# Altium schematic sheet External Temp Sensor.SchDoc
size A4; SheetNumber: 1; SheetTotal: 1
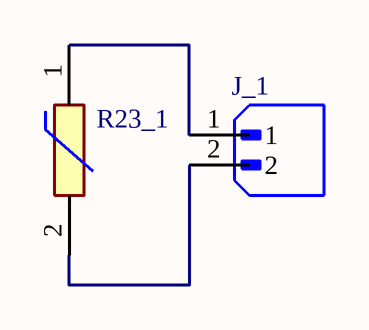
[diagram p0: External Temp Sensor.SchDoc]

## Parts
J_1  B2B-XH-A(LF)(SN)  [JST_B2B-XH-A(LF)(SN)]  (value not drawn)
R23_1  NTCS0805E3104GMT  [THRMC2012X95N]  (value not drawn)

## Nets
NetJ_1_1: J_1.1 R23_1.1
NetJ_1_2: J_1.2 R23_1.2

## Library data of the parts
J_1 = B2B-XH-A(LF)(SN): Connector Header Through Hole 2 position 0.098 (2.50mm); MF: JST Sales America Inc.; SnapEDA_Link: https://www.snapeda.com/parts/B2B-XH-A(LF)(SN)/JST+Sales+America+Inc./view-part/?ref=snap; Package: None; Value: *; MP: B2B-XH-A(LF)(SN); Check_prices: https://www.snapeda.com/parts/B2B-XH-A(LF)(SN)/JST+Sales+America+Inc./view-part/?ref=eda
R23_1 = NTCS0805E3104GMT: Thermistor; Manufacturer_Name: Vishay; Datasheet Link: http://www.vishay.com/docs/29044/ntcs0805e3t.pdf; Height: 0.95mm; Manufacturer_Part_Number: NTCS0805E3104GMT; Mouser Part Number: 594-NTCS0805E3104GMT; Mouser Price/Stock: https://www.mouser.co.uk/ProductDetail/Vishay-BC-Components/NTCS0805E3104GMT?qs=%2FWiulJ9oly70BwjDbuc51g%3D%3D